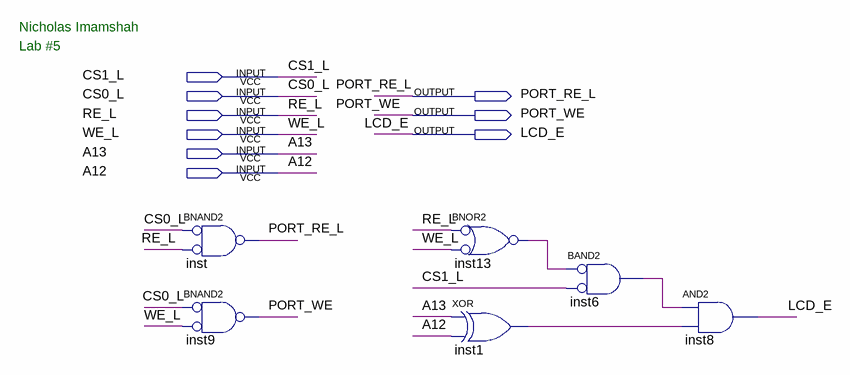
[diagram p0: schematic sheet]
// Quartus schematic cpld_config.bdf as structural Verilog: 6 symbols, 9 pins
module cpld_config (
  input  CS1_L,
  input  CS0_L,
  input  RE_L,
  input  WE_L,
  input  A13,
  input  A12,
  output PORT_RE_L,
  output PORT_WE,
  output LCD_E
);

  wire inst1_out, inst6_out, inst13_out;

  nand inst (PORT_RE_L, ~CS0_L, ~RE_L);  // BNAND2
  nand inst9 (PORT_WE, ~CS0_L, ~WE_L);  // BNAND2
  nor inst13 (inst13_out, ~RE_L, ~WE_L);  // BNOR2
  xor inst1 (inst1_out, A13, A12);
  and inst6 (inst6_out, ~inst13_out, ~CS1_L);  // BAND2
  and inst8 (LCD_E, inst6_out, inst1_out);

  // Notes on the sheet:
  //   Nicholas Imamshah
  //   Lab #5
endmodule
